# Altium schematic sheet 02 AUDIO CODEC.SchDoc
size A3; SheetNumber: 3; SheetTotal: 16
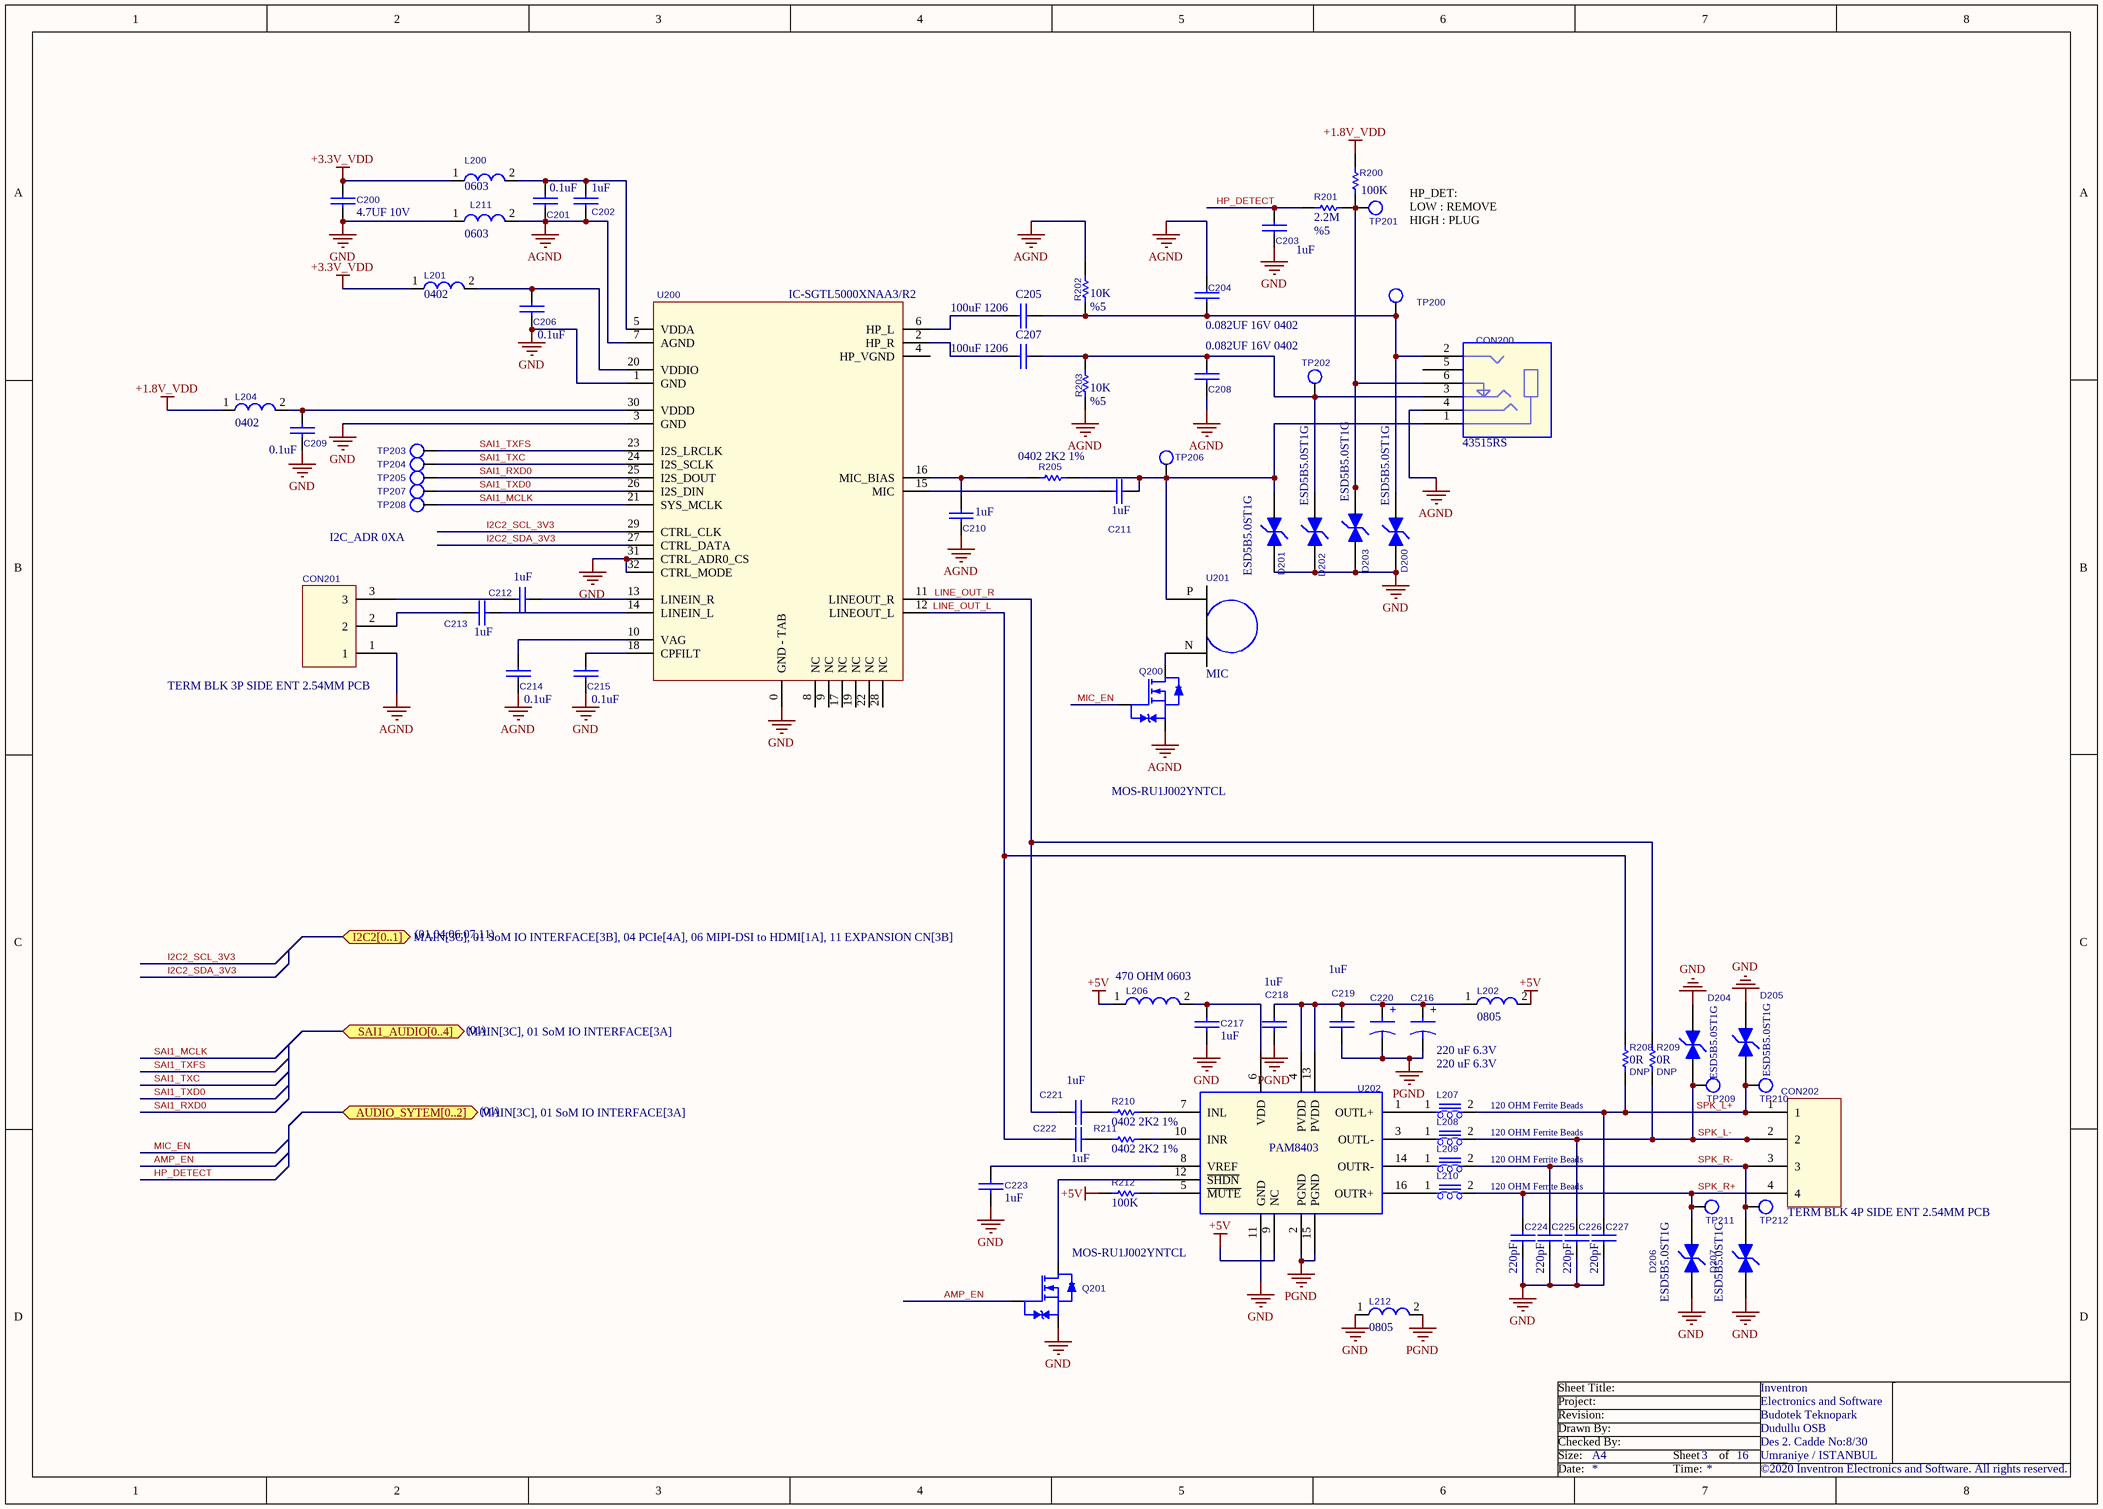
[diagram p0: 02 AUDIO CODEC.SchDoc]

## Parts
C200  4.7UF 10V  [0402_CC]
C201  0.1uF  [0402_CC]
C202  1uF  [0603_CC]
C203  1uF  [0603_CC]
C204  0.082UF 16V 0402  [0402_CC]
C205  100uF 1206  [1206]
C206  0.1uF  [0402_CC]
C207  100uF 1206  [1206]
C208  0.082UF 16V 0402  [0402_CC]
C209  0.1uF  [0402_CC]
C210  1uF  [0603_CC]
C211  1uF  [0603_CC]
C212  1uF  [0603_CC]
C213  1uF  [0603_CC]
C214  0.1uF  [0402_CC]
C215  0.1uF  [0402_CC]
C216  220 uF 6.3V  [CAP ALUM 6.6x6.6x5.4]
C217  1uF  [0603_CC]
C218  1uF  [0603_CC]
C219  1uF  [0603_CC]
C220  220 uF 6.3V  [CAP ALUM 6.6x6.6x5.4]
C221  1uF  [0603_CC]
C222  1uF  [0603_CC]
C223  1uF  [0603_CC]
C224  220pF  [0402_CC]
C225  220pF  [0402_CC]
C226  220pF  [0402_CC]
C227  220pF  [0402_CC]
CON200  43515RS  [SJ-43515RS-SMT]
CON201  TERM BLK 3P SIDE ENT 2.54MM PCB  [OSTVN03A150]
CON202  TERM BLK 4P SIDE ENT 2.54MM PCB  [OSTVN04A150]
D200  ESD5B5.0ST1G  [SOD523 - SZESD]
D201  ESD5B5.0ST1G  [SOD523 - SZESD]
D202  ESD5B5.0ST1G  [SOD523 - SZESD]
D203  ESD5B5.0ST1G  [SOD523 - SZESD]
D204  ESD5B5.0ST1G  [SOD523 - SZESD]
D205  ESD5B5.0ST1G  [SOD523 - SZESD]
D206  ESD5B5.0ST1G  [SOD523 - SZESD]
D207  ESD5B5.0ST1G  [SOD523 - SZESD]
L200  0603  [0603_RES]
L201  0402  [0402_RES]
L202  0805  [0805]
L204  0402  [0402_RES]
L206  470 OHM 0603  [0603_RES]
L207  120 OHM Ferrite Beads  [0603_RES]
L208  120 OHM Ferrite Beads  [0603_RES]
L209  120 OHM Ferrite Beads  [0603_RES]
L210  120 OHM Ferrite Beads  [0603_RES]
L211  0603  [0603_RES]
L212  0805  [0805]
Q200  MOS-RU1J002YNTCL  [SC-85-3/SOT-323FL]
Q201  MOS-RU1J002YNTCL  [SC-85-3/SOT-323FL]
R200  100K  [0402_RES]
R201  2.2M  Tolerance: %5  [0402_RES]
R202  10K  Tolerance: %5  [0402_RES]
R203  10K  Tolerance: %5  [0402_RES]
R205  0402 2K2 1%  [0402_RES]
R208  0R  ASSY_OPT: DNP  [0402_RES]  (no BOM)
R209  0R  ASSY_OPT: DNP  [0402_RES]  (no BOM)
R210  0402 2K2 1%  [0402_RES]
R211  0402 2K2 1%  [0402_RES]
R212  100K  [0402_RES]
TP200  TEST POINT 15  [testpoint_15]  (value not drawn)  (no BOM)
TP201  TEST POINT 15  [testpoint_15]  (value not drawn)  (no BOM)
TP202  TEST POINT 15  [testpoint_15]  (value not drawn)  (no BOM)
TP203  TEST POINT 15  [testpoint_15]  (value not drawn)  (no BOM)
TP204  TEST POINT 15  [testpoint_15]  (value not drawn)  (no BOM)
TP205  TEST POINT 15  [testpoint_15]  (value not drawn)  (no BOM)
TP206  TEST POINT 15  [testpoint_15]  (value not drawn)  (no BOM)
TP207  TEST POINT 15  [testpoint_15]  (value not drawn)  (no BOM)
TP208  TEST POINT 15  [testpoint_15]  (value not drawn)  (no BOM)
TP209  TEST POINT 15  [testpoint_15]  (value not drawn)  (no BOM)
TP210  TEST POINT 15  [testpoint_15]  (value not drawn)  (no BOM)
TP211  TEST POINT 15  [testpoint_15]  (value not drawn)  (no BOM)
TP212  TEST POINT 15  [testpoint_15]  (value not drawn)  (no BOM)
U200  IC-SGTL5000XNAA3/R2  [QFN32]
U201  MIC  [CMEJ-0415-42-P CON]
U202  PAM8403  [SO-16]

## Ports
AUDIO_SYTEM[0..2] (bidir, see MAIN[3C], 01 SoM IO INTERFACE[3A]), I2C2[0..1] (bidir, see MAIN[3C], 01 SoM IO INTERFACE[3B], 04 PCIe[4A], 06 MIPI-DSI to HDMI[1A], 11 EXPANSION CN[3B]), SAI1_AUDIO[0..4] (bidir, see MAIN[3C], 01 SoM IO INTERFACE[3A])

## Nets
+1.8V_VDD: L204.1 R200.2
+3.3V_VDD: C200.1 L200.1 L201.1
+5V: L202.2 L206.1 R212.1 U202.9(NC)
AGND: C201.2 C202.1 C204.1 C208.2 C210.1 C214.2 CON200.4 CON201.1 L211.2 Q200.2(S) R202.2 R203.2 U200.7(AGND)
GND: C200.2 C203.1 C206.2 C209.2 C215.2 C217.2 C223.2 C224.2 C225.2 C226.2 C227.2 D200.1(A) D201.1(A) D202.1(A) D203.1(A) D204.2(K) D205.2(K) D206.1(A) D207.1(A) L211.1 L212.1 Q201.2(S) U200.0(GND_-_TAB) U200.1(GND) U200.3(GND) U200.31(CTRL_ADR0_CS) U200.32(CTRL_MODE) U202.11(GND)
PGND: C216.2 C218.2 C219.2 C220.2 L212.2 U202.2(PGND) U202.15(PGND)
AMP_EN: Q201.1(G)
HP_DETECT: C203.2 R201.1
I2C2_SCL_3V3: U200.29(CTRL_CLK)
I2C2_SDA_3V3: U200.27(CTRL_DATA)
LINE_OUT_L: C222.1 R208.2 U200.12(LINEOUT_L)
LINE_OUT_R: C221.1 R209.2 U200.11(LINEOUT_R)
MIC_EN: Q200.1(G)
SAI1_MCLK: TP208.1 U200.21(SYS_MCLK)
SAI1_RXD0: TP205.1 U200.25(I2S_DOUT)
SAI1_TXC: TP204.1 U200.24(I2S_SCLK)
SAI1_TXD0: TP207.1 U200.26(I2S_DIN)
SAI1_TXFS: TP203.1 U200.23(I2S_LRCLK)
SPK_L+: C227.1 CON202.1 D205.1(A) L207.2 R208.1 TP210.1
SPK_L-: C226.1 CON202.2 D204.1(A) L208.2 R209.1 TP209.1
SPK_R+: C224.1 CON202.4 D206.2(K) L210.2 TP211.1
SPK_R-: C225.1 CON202.3 D207.2(K) L209.2 TP212.1
NetC201_1: C201.1 C202.2 L200.2 U200.5(VDDA)
NetC204_2: C204.2 C205.2 CON200.2 D200.2(K) R202.1 TP200.1
NetC205_1: C205.1 U200.6(HP_L)
NetC206_1: C206.1 L201.2 U200.20(VDDIO)
NetC207_1: C207.1 U200.2(HP_R)
NetC207_2: C207.2 C208.1 CON200.3 D202.2(K) R203.1 TP202.1
NetC209_1: C209.1 L204.2 U200.30(VDDD)
NetC210_2: C210.2 R205.1 U200.16(MIC_BIAS)
NetC211_1: C211.1 U200.15(MIC)
NetC211_2: C211.2 CON200.1 D201.2(K) R205.2 TP206.1 U201.P
NetC212_1: C212.1 CON201.3
NetC212_2: C212.2 U200.13(LINEIN_R)
NetC213_1: C213.1 CON201.2
NetC213_2: C213.2 U200.14(LINEIN_L)
NetC214_1: C214.1 U200.10(VAG)
NetC215_1: C215.1 U200.18(CPFILT)
NetC216_1: C216.1 C218.1 C219.1 C220.1 L202.1 U202.4(PVDD) U202.13(PVDD)
NetC217_1: C217.1 L206.2 U202.6(VDD)
NetC221_2: C221.2 R210.1
NetC222_2: C222.2 R211.1
NetC223_1: C223.1 U202.8(VREF)
NetCON200_6: CON200.6 D203.2(K) R200.1 R201.2 TP201.1
NetL207_1: L207.1 U202.1(OUTL+)
NetL208_1: L208.1 U202.3(OUTL-)
NetL209_1: L209.1 U202.14(OUTR-)
NetL210_1: L210.1 U202.16(OUTR+)
NetQ200_3: Q200.3(D) U201.N
NetQ201_3: Q201.3(D) U202.12(~{SHDN})
NetR210_2: R210.2 U202.7(INL)
NetR211_2: R211.2 U202.10(INR)
NetR212_2: R212.2 U202.5(~{MUTE})

Not connected (* = marked no-connect by the designer): CON200 5; U200 4(HP_VGND) 8(NC) 9(NC) 17(NC) 19(NC) 22(NC) 28(NC)

## Notes on the sheet
- HP_DET:
  LOW : REMOVE
  HIGH : PLUG
- I2C_ADR 0XA
- (01,04,06,07,11)
- (01)
- Sheet Title:
- Inventron
- Size:
- Drawn By:
- Revision:
- Project:
- Checked By:
- A4
- Sheet
- of
- Budotek Teknopark
- Dudullu OSB
- Des 2. Cadde No:8/30
- Umraniye / ISTANBUL
- Electronics and Software
- Date:
- Time:
- ©2020 Inventron Electronics and Software. All rights reserved.
- (in symbol CAP-EEE-0JA221WP) +

## Library data of the parts
C200 = CAP-CL05A475MP5NRNC: CAP CER 4.7UF 10V X5R 0402; Manufacturer-1: Samsung Electro-Mechanics; Class: Capacitor; Manufacturer Part Number-1: CL05A475MP5NRNC; Footprint: 0402; Manufacturer-2: *; Manufacturer Part Number-2: *; Inventron Stock No: *; Created By: EE; Created Date: *; Checked By: *; ASSY_OPT: *; Dimensions: *; Unit Price: 5000; Revision Date/Note: *; Price Break: 0.01576; Opt. Temp.: *; Features: *
C201 C206 C209 C214 C215 = CAP-CL05B104KO5NNNC: CAP VER 0.1UF 16V X7R 0402; Manufacturer-1: SAMSUNG; Opt. Temp.: -55/+125; Class: Capacitor; Manufacturer Part Number-1: CL05B104KO5NNNC; Footprint: 0402; Manufacturer-2: *; Manufacturer Part Number-2: *; Inventron Stock No: *; Created By: LA; Created Date: 23.11.2018; Checked By: *; ASSY_OPT: *; Dimensions: *; Unit Price: 0,00499; Revision Date/Note: *; Price Break: 10K
C202 C203 C210-C213 C217-C219 C221-C223 = CAP-CL10B105KA8NNNC: CAP CER 1UF 25V X7R 0603; Manufacturer-1: SAMSUNG; Class: Capacitor; Manufacturer Part Number-1: CL10B105KA8NNNC; Footprint: *; Manufacturer-2: *; Manufacturer Part Number-2: *; Inventron Stock No: *; Created By: LA; Created Date: *; Checked By: *; ASSY_OPT: *; Dimensions: *; Unit Price: *; Revision Date/Note: *; Price Break: *; Opt. Temp.: *; Features: *
C204 C208 = CAP-CL05B823KO5NNNC: CAP CER 0.082UF 16V X7R 0402; Manufacturer-1: Samsung Electro-Mechanics; Class: Capacitor; Manufacturer Part Number-1: CL05B823KO5NNNC; Footprint: 0402; Manufacturer-2: *; Manufacturer Part Number-2: *; Inventron Stock No: *; Created By: E.E; Created Date: 6.11.2020; Checked By: *; ASSY_OPT: *; Dimensions: *; Unit Price: *; Revision Date/Note: *; Price Break: *; Opt. Temp.: *; Features: *
C205 C207 = CAP-CL31A107MQHNNNE: CAP CER 100UF 6.3V X5R 1206; Manufacturer-1: Samsung Electro-Mechanics; Class: Capacitor; Manufacturer Part Number-1: CL31A107MQHNNNE; Manufacturer-2: *; Manufacturer Part Number-2: *; Inventron Stock No: *; Created By: EE; Created Date: *; Checked By: *; ASSY_OPT: *; Dimensions: *; Unit Price: *; Revision Date/Note: *; Price Break: *; Opt. Temp.: *; Features: *
C216 C220 = CAP-EEE-0JA221WP: CAP ALUM 220UF 20% 6.3V SMD; Manufacturer-1: PANASONIC; Opt. Temp.: -40/+85; Class: Capacitor; Manufacturer Part Number-1: EEE-0JA221WP; Footprint: *; Manufacturer-2: *; Manufacturer Part Number-2: *; Inventron Stock No: *; Created By: LA; Created Date: 17.10.2019; Checked By: *; ASSY_OPT: *; Dimensions: *; Unit Price: 0.093; Revision Date/Note: *; Price Break: 1K
C224-C227 = CAP-CL05C221JB5NNNC: 220pF ±5% 50V Ceramic Capacitor C0G, NP0 0402 (1005 Metric); Manufacturer-1: Samsung Electro-Mechanics; Manufacturer Part Number-1: CL05C221JB5NNNC; Footprint: 0402; Manufacturer-2: *; Manufacturer Part Number-2: *; Inventron Stock No: *; Created By: EE; Created Date: *; Checked By: *; ASSY_OPT: *; Dimensions: *; Unit Price: *; Revision Date/Note: *; Price Break: *; Opt. Temp.: *; Class: Capacitor; Features: *
CON200 = CON-SJ-43515RS-SMT-TR: CONN JACK 4COND 3.5MM SMD R/A; Manufacturer-1: CUI; Opt. Temp.: -20/+85; Class: Connector; Manufacturer Part Number-1: SJ-43515RS-SMT-TR; Footprint: *; Manufacturer-2: *; Manufacturer Part Number-2: *; Inventron Stock No: *; Created By: LA; Created Date: 19.04.2019; Checked By: *; ASSY_OPT: *; Dimensions: *; Unit Price: 0,5888; Revision Date/Note: *; Price Break: 1K
CON201 = CON-OSTVN03A150: 3 Position Wire to Board Terminal Block Horizontal with Board 0.100" (2.54mm) Through Hole; Manufacturer-1: On Shore Technology Inc.; Class: Connector; Manufacturer Part Number-1: OSTVN03A150; Footprint: 2.54mm; Manufacturer-2: *; Manufacturer Part Number-2: *; Inventron Stock No: *; Created By: E.E; Created Date: *; Checked By: *; ASSY_OPT: *; Dimensions: *; Unit Price: 0.43520; Revision Date/Note: *; Price Break: 1000; Opt. Temp.: *; Features: *
CON202 = CON-OSTVN04A150: 4 Position Wire to Board Terminal Block Horizontal with Board 0.100" (2.54mm) Through Hole; Manufacturer-1: On Shore Technology Inc.; Class: Connector; Manufacturer Part Number-1: OSTVN04A150; Footprint: 2.54mm; Manufacturer-2: *; Manufacturer Part Number-2: OSTVN04A150; Inventron Stock No: *; Created By: E.E; Created Date: *; Checked By: *; ASSY_OPT: *; Dimensions: *; Unit Price: 0.5808; Revision Date/Note: *; Price Break: 1000; Opt. Temp.: *; Features: *
D200-D207 = DIODE-ESD5B5.0ST1G: VS DIODE 5V SOD523; Manufacturer-1: ON Semiconductor; Opt. Temp.: -55/+150; Manufacturer Part Number-1: ESD5B5.0ST1G; Footprint: SOD-523; Manufacturer-2: *; Manufacturer Part Number-2: *; Inventron Stock No: *; Created By: E.E; Created Date: 3.11.2020; Checked By: *; ASSY_OPT: *; Dimensions: *; Unit Price: 0,0129; Revision Date/Note: *; Price Break: 3000; Class: Diode; Features: AUTOMOTIVE
L200 L211 = IND-FERRITE (RES 0 OHM) 0603: 0OHM 0603; Manufacturer Part Number-1: RC0603JR-070RL; Manufacturer-1: YAGEO; Class: Inductor; Footprint: 0603; Manufacturer-2: *; Inventron Stock No: *; Created By: EE; Checked By: *; ASSY_OPT: *; Dimensions: *; Revision Date/Note: *
L201 L204 = IND-FERRITE (RES 0 OHM) 0402: 0OHM 0402; Manufacturer Part Number-1: RMCF0402ZT0R00; Manufacturer-1: Stackpole Electronics Inc; Class: Inductor; Footprint: 0402; Manufacturer-2: *; Inventron Stock No: *; Created By: EE; Checked By: *; ASSY_OPT: *; Dimensions: *; Unit Price: 0.00186; Revision Date/Note: *; Price Break: 1000
L202 L212 = IND-FERRITE (RES 0 OHM) 0805: 0OHM 0805; Manufacturer Part Number-1: AC0805JR-070RL; Manufacturer-1: YAGEO; Class: Inductor; Manufacturer-2: *; Inventron Stock No: *; Created By: EE; Checked By: *; ASSY_OPT: *; Dimensions: *; Revision Date/Note: *
L206 = IND-BLM18EG471SN1D: - Ferrite Bead 0603 (1608 Metric) 500mA 210mOhm; Manufacturer-1: Murata Electronics; Class: Inductor; Manufacturer Part Number-1: BLM18EG471SN1D; Footprint: 0603; Manufacturer-2: *; Manufacturer Part Number-2: *; Inventron Stock No: *; Created By: E.E; Created Date: 6.11.2020; Checked By: *; ASSY_OPT: *; Dimensions: *; Unit Price: *; Revision Date/Note: *; Price Break: *; Opt. Temp.: *; Features: *
L207-L210 = IND-BLM18PG121SH1D: Ferrite Beads Multi-Layer 120Ohm 25% 100MHz 2A 0.05Ohm DCR 0603 Automotive T/R; Manufacturer-1: Murata Manufacturing; Class: Inductor; Manufacturer Part Number-1: BLM18PG121SH1D; Footprint: 0603; Manufacturer-2: *; Manufacturer Part Number-2: *; Inventron Stock No: *; Created By: E.E; Created Date: 2.11.2020; Checked By: *; ASSY_OPT: *; Dimensions: *; Unit Price: 0.02550; Revision Date/Note: *; Price Break: 4000; Opt. Temp.: *; Features: *
Q200 Q201 = MOS-RU1J002YNTCL: MOSFET N-CH 50V 0.2A UMT3F; Manufacturer-1: ROHM; Opt. Temp.: -55/+150; Class: Transistor; Manufacturer Part Number-1: RU1J002YNTCL; Footprint: SC-85; Manufacturer-2: *; Manufacturer Part Number-2: *; Inventron Stock No: *; Created By: LA; Created Date: 23.11.2018; Checked By: *; ASSY_OPT: *; Dimensions: *; Unit Price: 0,0384; Revision Date/Note: *; Price Break: 3K
R200 R212 = RES-RMCF0402JT100K: RES 100K OHM 5% 1/16W 0402; Manufacturer-1: STACKPOLE; Opt. Temp.: -55/+155; Class: Resistor; Tolerance: %5; Manufacturer Part Number-1: RMCF0402JT100K; Footprint: 0402; Manufacturer-2: *; Manufacturer Part Number-2: *; Inventron Stock No: *; Created By: LA; Created Date: 23.11.2018; Checked By: *; ASSY_OPT: *; Dimensions: *; Unit Price: 0,00127; Revision Date/Note: *; Price Break: 10K; Features: AUTOMOTIVE
R201 = RES-RMCF0402JT2M20: RES 2.2M OHM 5% 1/16W 0402; Manufacturer-1: STACKPOLE; Opt. Temp.: -55/+155; Class: Resistor; Manufacturer Part Number-1: RMCF0402JT2M20; Footprint: 0402; Manufacturer-2: *; Manufacturer Part Number-2: *; Inventron Stock No: *; Created By: LA; Created Date: 23.11.2018; Checked By: *; ASSY_OPT: *; Dimensions: *; Unit Price: 0,00127; Revision Date/Note: *; Price Break: 10K
R202 R203 = RES-RMCF0402JT10K0: RES 10K OHM 5% 1/16W 0402; Manufacturer-1: STACKPOLE; Opt. Temp.: -55/+155; Class: Resistor; Manufacturer Part Number-1: RMCF0402JT10K0; Footprint: 0402; Manufacturer-2: *; Manufacturer Part Number-2: *; Inventron Stock No: *; Created By: LA; Created Date: 23.11.2018; Checked By: *; ASSY_OPT: *; Dimensions: *; Unit Price: 0,00127; Revision Date/Note: *; Price Break: 10K
R205 R210 R211 = RES-CRGCQ0402F2K2: 2.2 ±1% 0.063W, 1/16W Chip Resistor 0402 (1005 Metric) Automotive AEC-Q200, Moisture Resistant Thick Film; Manufacturer-1: TE Connectivity Passive Product; Opt. Temp.: -55°C ~ 155°C; Manufacturer Part Number-1: CRGCQ0402F2K2; Footprint: 0402; Manufacturer-2: *; Manufacturer Part Number-2: *; Inventron Stock No: *; Created By: E.E; Created Date: 22.10.2020; Checked By: *; ASSY_OPT: *; Dimensions: *; Unit Price: *; Revision Date/Note: *; Price Break: *; Class: Resistor; Tolerance: *
R208 R209 = RES-RMCF0402ZT0R00: RES 0 OHM JUMPER 1/16W 0402; Manufacturer-1: STACKPOLE; Opt. Temp.: -55/+155; Class: Resistor; Manufacturer Part Number-1: RMCF0402ZT0R00; Footprint: 0402; Manufacturer-2: *; Manufacturer Part Number-2: *; Inventron Stock No: *; Created By: LA; Created Date: 23.11.2018; Checked By: *; Dimensions: *; Unit Price: 0,00127; Revision Date/Note: *; Price Break: 10K
U200 = IC-SGTL5000XNAA3/R2: IC AUDIO CODEC  STEREO SMD QFN32; Manufacturer-1: NXP; Opt. Temp.: -40/+85; Class: ICs; Manufacturer Part Number-1: SGTL5000XNAA3/R2; Manufacturer-2: *; Manufacturer Part Number-2: *; Inventron Stock No: *; Created By: OKS; Created Date: 29.04.2019; Checked By: *; ASSY_OPT: *; Dimensions: *; Unit Price: 1,83; Revision Date/Note: *; Price Break: 1K
U201 = IC-CMEJ-0415-42-P: 100Hz ~ 10kHz Analog Microphone Electret Condenser Omnidirectional (-42dB ±3dB @ 94dB SPL) PC Pins; Manufacturer-1: CUI Devices; Class: ICs; Manufacturer Part Number-1: CMEJ-0415-42-P; Footprint: *; Manufacturer-2: *; Manufacturer Part Number-2: *; Inventron Stock No: *; Created By: E.E; Created Date: 11.11.2020; Checked By: *; ASSY_OPT: *; Dimensions: *; Unit Price: 0.24864; Revision Date/Note: *; Price Break: 1000; Opt. Temp.: *
U202 = IC-PAM8403: IC AMP AUDIO 3W CLASS D SO16; Manufacturer Part Number-1: PAM8403DR; Manufacturer-1: DIODES; Opt. Temp.: -40/+85; Class: ICs; Footprint: SOIC 16; Manufacturer-2: *; Manufacturer Part Number-2: *; Inventron Stock No: *; Created By: OKS; Created Date: 03.05.2019; Checked By: *; ASSY_OPT: *; Dimensions: *; Unit Price: 0.31; Revision Date/Note: *; Price Break: 2.5K